# Altium schematic sheet Module_Esp32.SchDoc
size A4
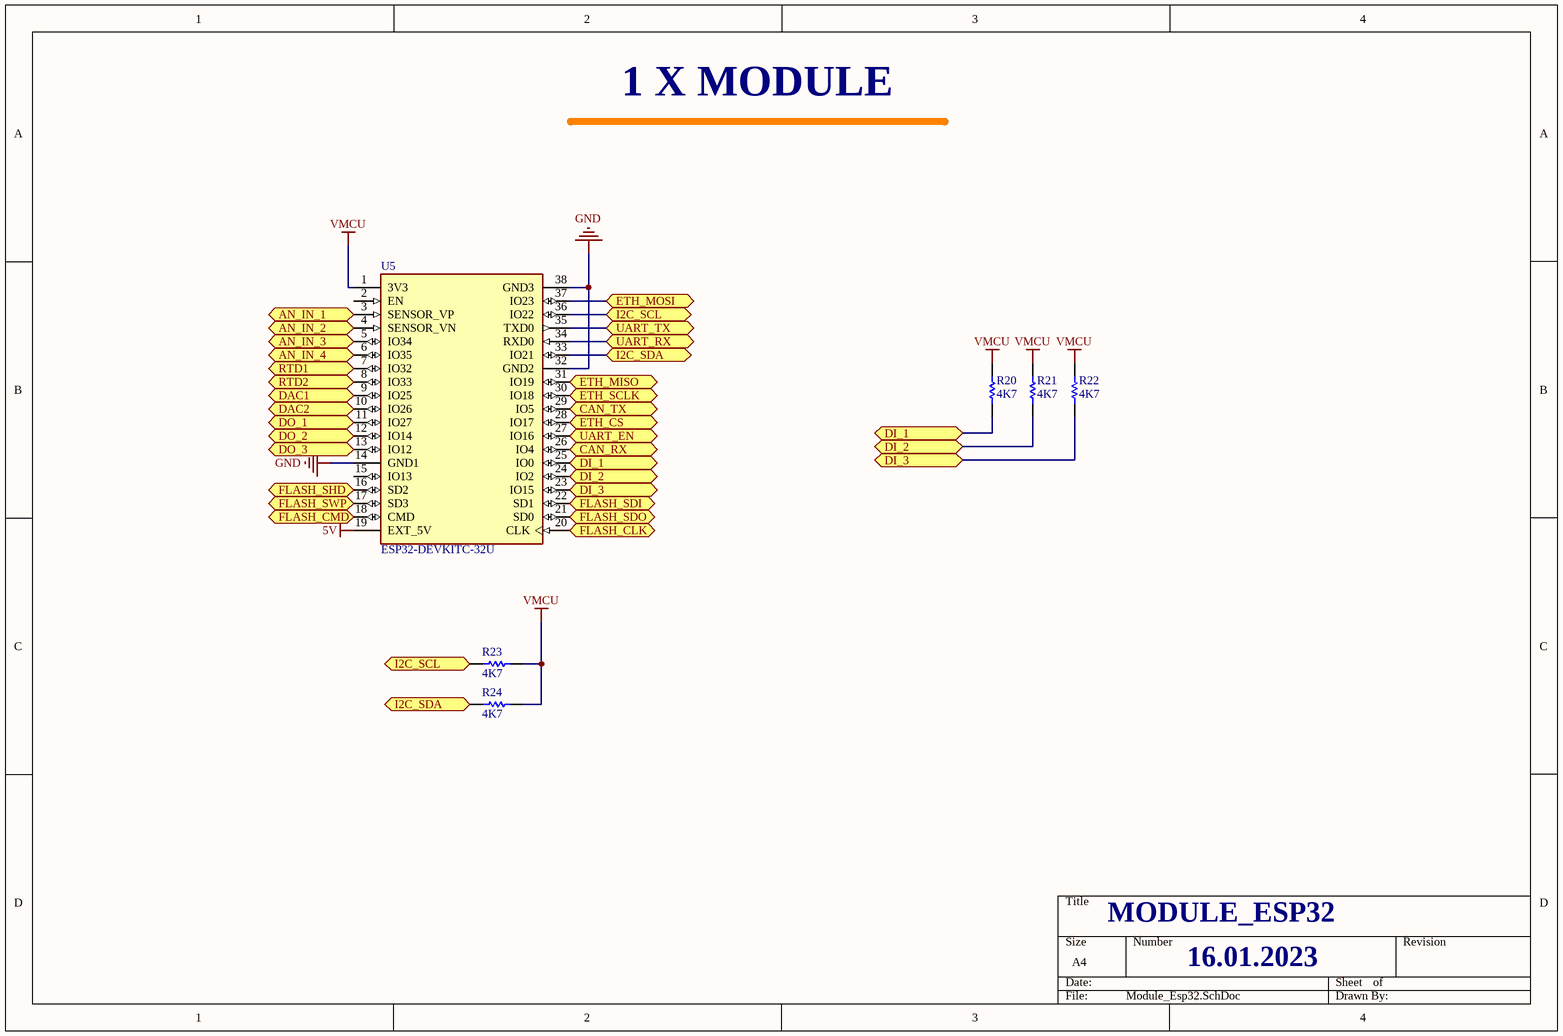
[diagram p0: Module_Esp32.SchDoc]

## Parts
R20  4K7  [RES1608[0603]]
R21  4K7  [RES1608[0603]]
R22  4K7  [RES1608[0603]]
R23  4K7  [RES1608[0603]]
R24  4K7  [RES1608[0603]]
U5  ESP32-DEVKITC-32U  [MODULE_ESP32-DEVKITC-32U]

## Ports
AN_IN_1, AN_IN_2, AN_IN_3, AN_IN_4, CAN_RX, CAN_TX, DAC1, DAC2, DI_1, DI_2, DI_3, DO_1, DO_2, DO_3, ETH_CS, ETH_MISO, ETH_MOSI, ETH_SCLK, FLASH_CLK, FLASH_CMD, FLASH_SDI, FLASH_SDO, FLASH_SHD, FLASH_SWP, I2C_SCL, I2C_SDA, RTD1, RTD2, UART_EN, UART_RX, UART_TX

## Nets
5V: U5.19(EXT_5V)
GND: U5.14(GND1) U5.32(GND2) U5.38(GND3)
VMCU: R20.1 R21.1 R22.1 R23.1 R24.1 U5.1(3V3)
AN_IN_1: U5.3(SENSOR_VP) ; port AN_IN_1
AN_IN_2: U5.4(SENSOR_VN) ; port AN_IN_2
AN_IN_3: U5.5(IO34) ; port AN_IN_3
AN_IN_4: U5.6(IO35) ; port AN_IN_4
CAN_RX: U5.26(IO4) ; port CAN_RX
CAN_TX: U5.29(IO5) ; port CAN_TX
DAC1: U5.9(IO25) ; port DAC1
DAC2: U5.10(IO26) ; port DAC2
DI_1: R20.2 U5.25(IO0) ; port DI_1
DI_2: R21.2 U5.24(IO2) ; port DI_2
DI_3: R22.2 U5.23(IO15) ; port DI_3
DO_1: U5.11(IO27) ; port DO_1
DO_2: U5.12(IO14) ; port DO_2
DO_3: U5.13(IO12) ; port DO_3
ETH_CS: U5.28(IO17) ; port ETH_CS
ETH_MISO: U5.31(IO19) ; port ETH_MISO
ETH_MOSI: U5.37(IO23) ; port ETH_MOSI
ETH_SCLK: U5.30(IO18) ; port ETH_SCLK
FLASH_CLK: U5.20(CLK) ; port FLASH_CLK
FLASH_CMD: U5.18(CMD) ; port FLASH_CMD
FLASH_SDI: U5.22(SD1) ; port FLASH_SDI
FLASH_SDO: U5.21(SD0) ; port FLASH_SDO
FLASH_SHD: U5.16(SD2) ; port FLASH_SHD
FLASH_SWP: U5.17(SD3) ; port FLASH_SWP
I2C_SCL: R23.2 U5.36(IO22) ; port I2C_SCL
I2C_SDA: R24.2 U5.33(IO21) ; port I2C_SDA
RTD1: U5.7(IO32) ; port RTD1
RTD2: U5.8(IO33) ; port RTD2
UART_EN: U5.27(IO16) ; port UART_EN
UART_RX: U5.34(RXD0) ; port UART_RX
UART_TX: U5.35(TXD0) ; port UART_TX

Not connected (* = marked no-connect by the designer): U5 2(EN) 15(IO13)

## Notes on the sheet
- 1 X MODULE
- MODULE_ESP32
- 16.01.2023

## Library data of the parts
R20-R22 = RES: RESISTOR 0805 Case %1; Value: 430R; Published: 8-Jun-2000; LatestRevisionDate: 17-Jul-2002; LatestRevisionNote: Re-released for DXP Platform.; PackageReference: AXIAL-0.5; Publisher: Altium Limited
R23 R24 = RES: RESISTOR 0603 Case %1; Value: 430R; Published: 8-Jun-2000; LatestRevisionDate: 17-Jul-2002; LatestRevisionNote: Re-released for DXP Platform.; PackageReference: AXIAL-0.5; Publisher: Altium Limited
U5 = ESP32-DEVKITC-32U: ESP32-DEVKITC; Availability: Unavailable; MP: ESP32-DEVKITC-32U; Value: *; Package: None; Price: None